# Altium schematic sheet Program_Counter.SchDoc
size B; Author: E. Sims; Organization: Let's Build Rockets Inc.; SheetNumber: 3; SheetTotal: 16
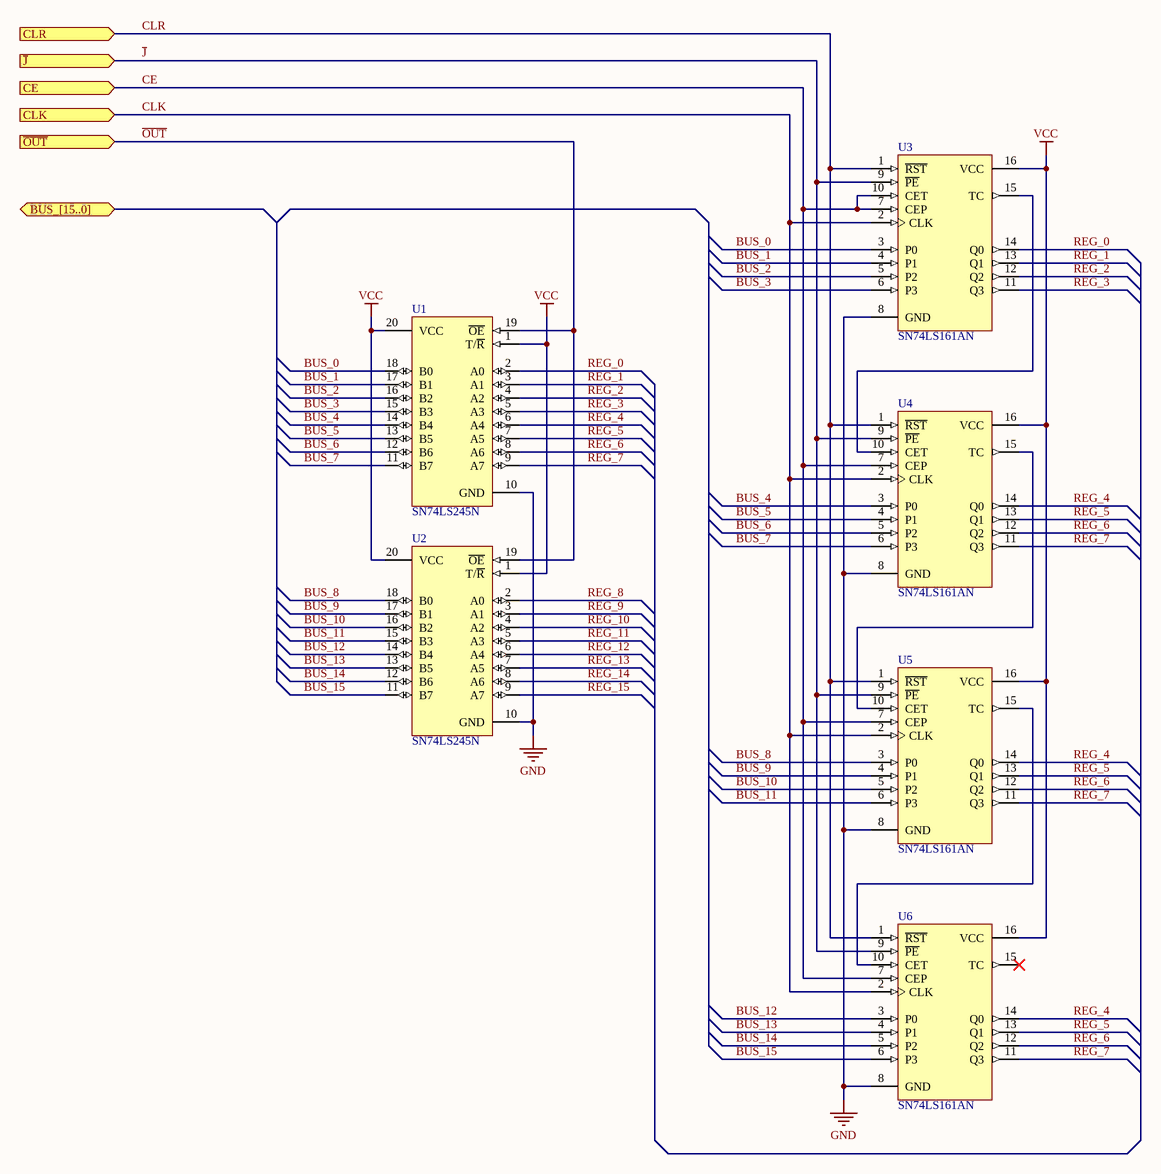
[diagram p0: Program_Counter.SchDoc]

## Parts
U1  SN74LS245N  [N020]
U2  SN74LS245N  [N020]
U3  SN74LS161AN  [N016]
U4  SN74LS161AN  [N016]
U5  SN74LS161AN  [N016]
U6  SN74LS161AN  [N016]

## Ports
BUS_[15..0] (bidir), CE (in), CLK (in), CLR (in), ~{J} (in), ~{OUT} (in)

## Nets
GND: U1.10(GND) U2.10(GND) U3.8(GND) U4.8(GND) U5.8(GND) U6.8(GND)
VCC: U1.1(T/~{R}) U1.20(VCC) U2.1(T/~{R}) U2.20(VCC) U3.16(VCC) U4.16(VCC) U5.16(VCC) U6.16(VCC)
BUS_0: U1.18(B0) U3.3(P0)
BUS_1: U1.17(B1) U3.4(P1)
BUS_2: U1.16(B2) U3.5(P2)
BUS_3: U1.15(B3) U3.6(P3)
BUS_4: U1.14(B4) U4.3(P0)
BUS_5: U1.13(B5) U4.4(P1)
BUS_6: U1.12(B6) U4.5(P2)
BUS_7: U1.11(B7) U4.6(P3)
BUS_8: U2.18(B0) U5.3(P0)
BUS_9: U2.17(B1) U5.4(P1)
BUS_10: U2.16(B2) U5.5(P2)
BUS_11: U2.15(B3) U5.6(P3)
BUS_12: U2.14(B4) U6.3(P0)
BUS_13: U2.13(B5) U6.4(P1)
BUS_14: U2.12(B6) U6.5(P2)
BUS_15: U2.11(B7) U6.6(P3)
CE: U3.7(CEP) U3.10(CET) U4.7(CEP) U5.7(CEP) U6.7(CEP) ; port CE
CLK: U3.2(CLK) U4.2(CLK) U5.2(CLK) U6.2(CLK) ; port CLK
CLR: U3.1(~{RST}) U4.1(~{RST}) U5.1(~{RST}) U6.1(~{RST}) ; port CLR
~{J}: U3.9(~{PE}) U4.9(~{PE}) U5.9(~{PE}) U6.9(~{PE}) ; port ~{J}
~{OUT}: U1.19(~{OE}) U2.19(~{OE}) ; port ~{OUT}
REG_0: U1.2(A0) U3.14(Q0)
REG_1: U1.3(A1) U3.13(Q1)
REG_2: U1.4(A2) U3.12(Q2)
REG_3: U1.5(A3) U3.11(Q3)
REG_4: U1.6(A4) U4.14(Q0) U5.14(Q0) U6.14(Q0)
REG_5: U1.7(A5) U4.13(Q1) U5.13(Q1) U6.13(Q1)
REG_6: U1.8(A6) U4.12(Q2) U5.12(Q2) U6.12(Q2)
REG_7: U1.9(A7) U4.11(Q3) U5.11(Q3) U6.11(Q3)
REG_8: U2.2(A0)
REG_9: U2.3(A1)
REG_10: U2.4(A2)
REG_11: U2.5(A3)
REG_12: U2.6(A4)
REG_13: U2.7(A5)
REG_14: U2.8(A6)
REG_15: U2.9(A7)
NetU3_15: U3.15(TC) U4.10(CET)
NetU4_15: U4.15(TC) U5.10(CET)
NetU5_15: U5.15(TC) U6.10(CET)

Not connected (* = marked no-connect by the designer): U6 15(TC)*

## Notes on the sheet
- Let's Build Rocket's Inc. Modular Paylaod System Based on TMP-010 Rev
  For more information visit https://github.com/LetsBuildRockets/Modular-Payload-System
  This work is licensed under CC BY-NC 4.0. To view a copy of this license, visit https://creativecommons.org/licenses/by-nc/4.0
- Title
- Size:
- Date:
- Assembly Variant:
- B
- Number:
- Time:
- Revision:
- Sheet
- of
- Author:
- File:

## Library data of the parts
U1 U2 = SN74LS245N: Octal Bus Transceiver with 3-State Outputs; Published: 8-Jun-2000; LatestRevisionDate: 04-Mar-2005; LatestRevisionNote: Stylized 3D Model Added.; DatasheetVersion: Mar-1988; PackageVersion: Oct-1995; PackageReference: N020; Publisher: Altium Limited; PackageDescription: DIP; 20 Leads; Row Spacing 7.62 mm; Pitch 2.54 mm; ComponentLink1Description: Manufacturer Link; ComponentLink1URL: http://www.ti.com/; ComponentLink2Description: Datasheet; ComponentLink2URL: http://www-s.ti.com/sc/ds/sn74ls245.pdf
U3-U6 = SN74LS161AN: Synchronous 4-Bit Counter; Published: 8-Jun-2000; LatestRevisionDate: 04-Mar-2005; LatestRevisionNote: Stylized 3D Model Added.; DatasheetVersion: Mar-1988; PackageVersion: Oct-1995; PackageReference: N016; Publisher: Altium Limited; PackageDescription: DIP; 16 Leads; Row Spacing 7.62 mm; Pitch 2.54 mm; Code_JEDEC: MS-001-BB; ComponentLink1Description: Manufacturer Link; ComponentLink1URL: http://www.ti.com/; ComponentLink2Description: Datasheet; ComponentLink2URL: http://www-s.ti.com/sc/ds/sn74ls161a.pdf; ComponentLink3Description: URL Link1; ComponentLink3URL: http://focus.ti.com/docs/prod/folders/print/sn74ls161a.html